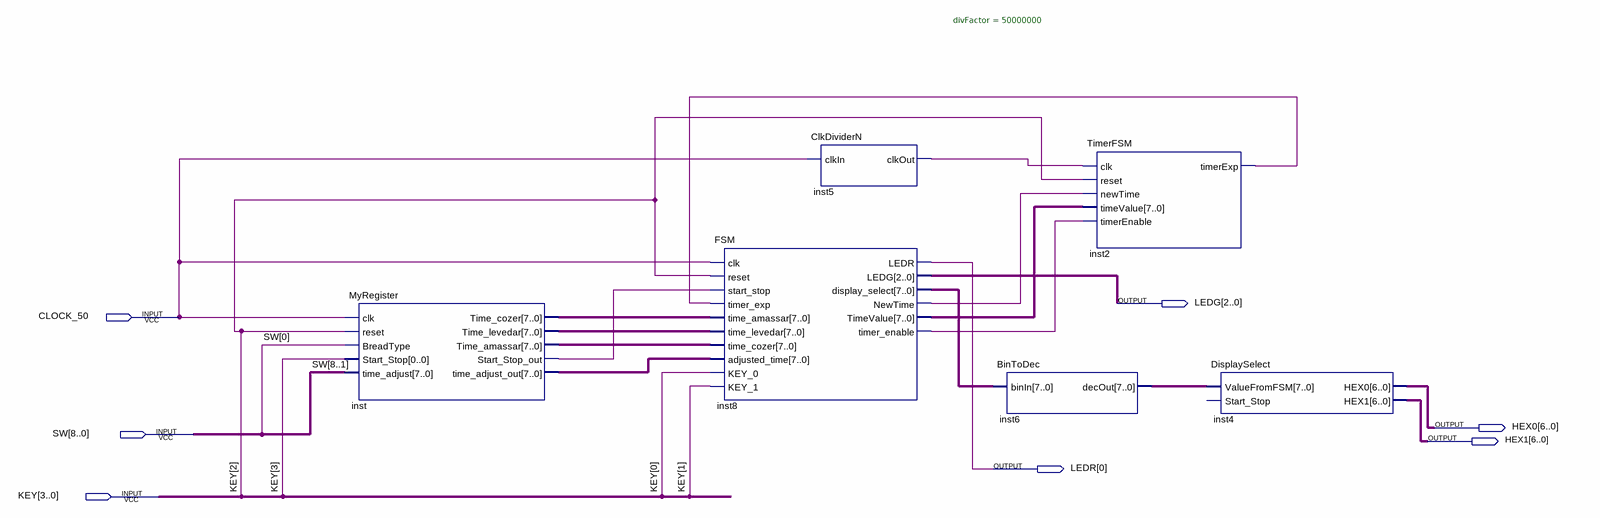
[diagram p0: schematic sheet]
// Quartus schematic Esquematico.bdf as structural Verilog: 6 symbols, 7 pins
module Esquematico (
  input  CLOCK_50,
  input  [8:0] SW,
  input  [3:0] KEY,
  output [2:0] LEDG,
  output [6:0] HEX0,
  output [6:0] HEX1,
  output [0:0] LEDR
);

  wire inst2_timerexp, inst5_clkout, inst8_newtime, inst8_timer_enable, inst_start_stop_out;
  wire [7:0] inst6_decout, inst8_display_select, inst8_timevalue, inst_time_adjust_out, inst_time_amassar,
       inst_time_cozer, inst_time_levedar;

  MyRegister inst (
    .clk(CLOCK_50), .reset(KEY[2]), .BreadType(SW[0]), .Start_Stop(KEY[3]), .time_adjust(SW[8:1]),
    .Time_cozer(inst_time_cozer), .Time_levedar(inst_time_levedar), .Time_amassar(inst_time_amassar),
    .Start_Stop_out(inst_start_stop_out), .time_adjust_out(inst_time_adjust_out));
  FSM inst8 (
    .clk(CLOCK_50), .reset(KEY[2]), .start_stop(inst_start_stop_out), .timer_exp(inst2_timerexp),
    .time_amassar(inst_time_cozer), .time_levedar(inst_time_levedar), .time_cozer(inst_time_amassar),
    .adjusted_time(inst_time_adjust_out), .KEY_0(KEY[0]), .KEY_1(KEY[1]), .LEDR(LEDR[0]), .LEDG(LEDG),
    .display_select(inst8_display_select), .NewTime(inst8_newtime), .TimeValue(inst8_timevalue),
    .timer_enable(inst8_timer_enable));
  ClkDividerN #(.divFactor(50000000)) inst5 (.clkIn(CLOCK_50), .clkOut(inst5_clkout));
  BinToDec inst6 (.binIn(inst8_display_select), .decOut(inst6_decout));
  TimerFSM inst2 (
    .clk(inst5_clkout), .reset(KEY[2]), .newTime(inst8_newtime), .timeValue(inst8_timevalue),
    .timerEnable(inst8_timer_enable), .timerExp(inst2_timerexp));
  DisplaySelect inst4 (.ValueFromFSM(inst6_decout), .HEX0(HEX0), .HEX1(HEX1));  // open: Start_Stop
endmodule
